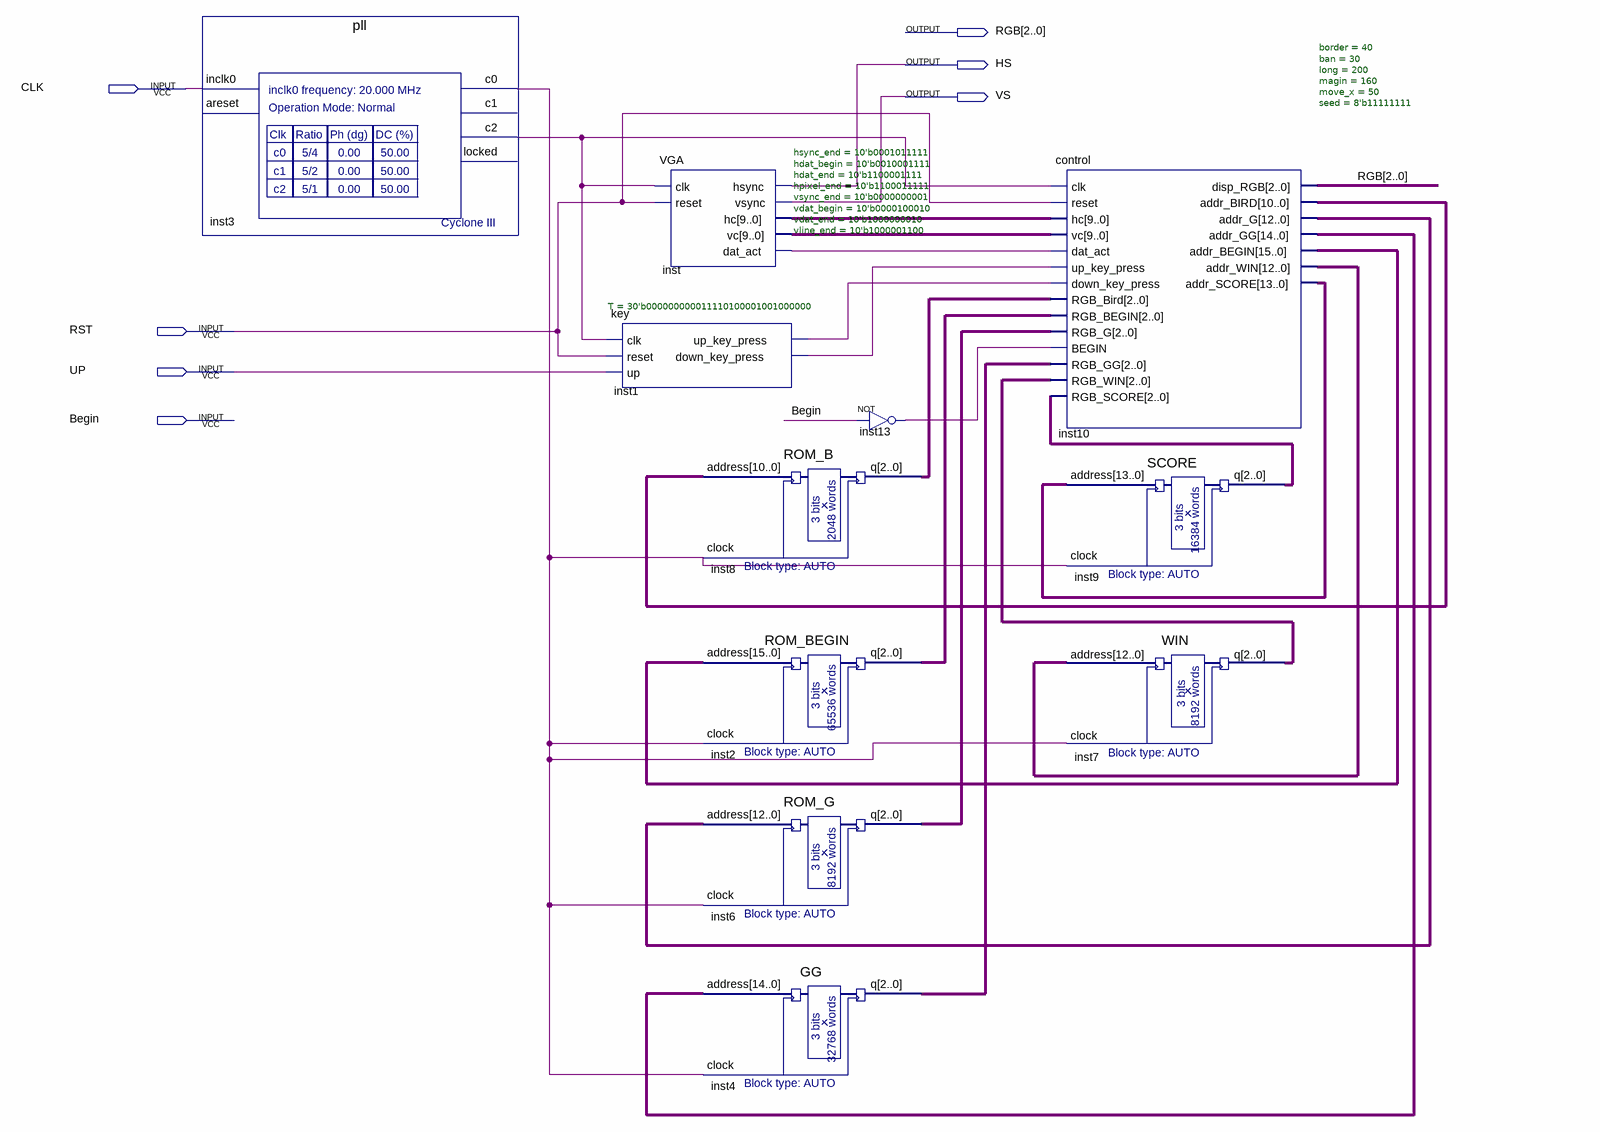
[diagram p0: schematic sheet]
// Quartus schematic gold.bdf as structural Verilog: 11 symbols, 7 pins
module gold (
  input  CLK,
  input  RST,
  input  UP,
  input  Begin,
  output [2:0] RGB,
  output HS,
  output VS
);

  wire inst1_down_key_press, inst1_up_key_press, inst3_c0, inst3_c2, inst13_out, inst_dat_act;
  wire [2:0] inst2_q, inst4_q, inst6_q, inst7_q, inst8_q, inst9_q;
  wire [9:0] inst_hc, inst_vc;
  wire [10:0] inst10_addr_bird;
  wire [12:0] inst10_addr_g, inst10_addr_win;
  wire [13:0] inst10_addr_score;
  wire [14:0] inst10_addr_gg;
  wire [15:0] inst10_addr_begin;

  pll inst3 (.inclk0(CLK), .c0(inst3_c0), .c2(inst3_c2));  // open: areset, c1, locked
  key #(.T(30'b000000000011110100001001000000)) inst1 (
    .clk(inst3_c2), .reset(RST), .up(UP), .up_key_press(inst1_up_key_press),
    .down_key_press(inst1_down_key_press));
  VGA #(.hsync_end(10'b0001011111), .hdat_begin(10'b0010001111), .hdat_end(10'b1100001111), .hpixel_end(10'b1100011111), .vsync_end(10'b0000000001), .vdat_begin(10'b0000100010), .vdat_end(10'b1000000010), .vline_end(10'b1000001100)) inst (
    .clk(inst3_c2), .reset(RST), .hsync(HS), .vsync(VS), .hc(inst_hc), .vc(inst_vc), .dat_act(inst_dat_act));
  ROM_B inst8 (.address(inst10_addr_bird), .clock(inst3_c0), .q(inst8_q));
  ROM_BEGIN inst2 (.address(inst10_addr_begin), .clock(inst3_c0), .q(inst2_q));
  ROM_G inst6 (.address(inst10_addr_g), .clock(inst3_c0), .q(inst6_q));
  GG inst4 (.address(inst10_addr_gg), .clock(inst3_c0), .q(inst4_q));
  not inst13 (inst13_out, Begin);
  control #(.border(40), .ban(30), .long(200), .magin(160), .move_x(50), .seed(8'b11111111)) inst10 (
    .clk(inst3_c2), .reset(RST), .hc(inst_hc), .vc(inst_vc), .dat_act(inst_dat_act),
    .up_key_press(inst1_down_key_press), .down_key_press(inst1_up_key_press), .RGB_Bird(inst8_q),
    .RGB_BEGIN(inst2_q), .RGB_G(inst6_q), .BEGIN(inst13_out), .RGB_GG(inst4_q), .RGB_WIN(inst7_q),
    .RGB_SCORE(inst9_q), .disp_RGB(RGB), .addr_BIRD(inst10_addr_bird), .addr_G(inst10_addr_g),
    .addr_GG(inst10_addr_gg), .addr_BEGIN(inst10_addr_begin), .addr_WIN(inst10_addr_win),
    .addr_SCORE(inst10_addr_score));
  SCORE inst9 (.address(inst10_addr_score), .clock(inst3_c0), .q(inst9_q));
  WIN inst7 (.address(inst10_addr_win), .clock(inst3_c0), .q(inst7_q));
endmodule
